# Altium schematic sheet [07] Power socket, roller feed.SchDoc
size 101 x 76 mm
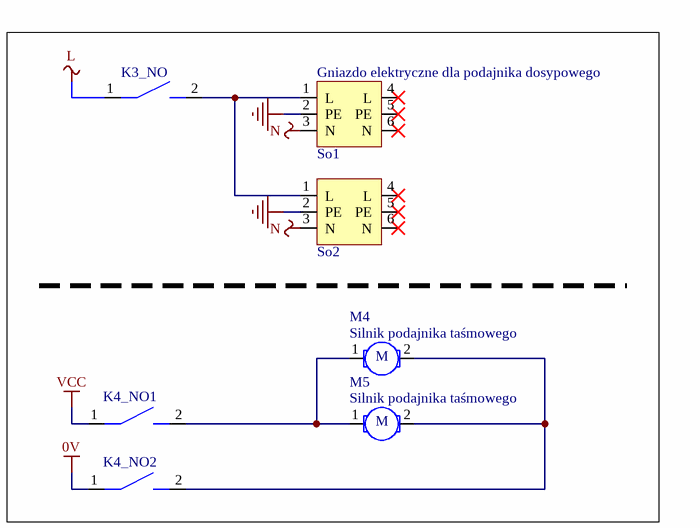
[diagram p0: [07] Power socket, roller feed.SchDoc]

## Parts
K3_NO  NO  (value not drawn)
K4_NO1  NO  (value not drawn)
K4_NO2  NO  (value not drawn)
M4  Silnik podajnika taśmowego
M5  Silnik podajnika taśmowego
So1  Gniazdo elektryczne dla podajnika dosypowego
So2  Power socket  (value not drawn)

## Nets
0V: K4_NO2.1
N: So1.3(N) So2.3(N)
NetSo1_2: So1.2(PE) So2.2(PE)
VCC: K4_NO1.1
NetK3_NO_2: K3_NO.2 So1.1(L) So2.1(L)
NetK4_NO1_2: K4_NO1.2 M4.1 M5.1
NetK4_NO2_2: K4_NO2.2 M4.2 M5.2

Not connected (* = marked no-connect by the designer): K3_NO 1(*); So1 4(L)* 5(PE)* 6(N)*; So2 4(L)* 5(PE)* 6(N)*

## Notes on the sheet
- Labels drawn without touching a wire or pin: L
- (in symbol DC motor) M

## Library data of the parts
M4 M5 = DC motor
So1 = Power socket